# EAGLE schematic SIS Hub (EAGLE 7.3.0)
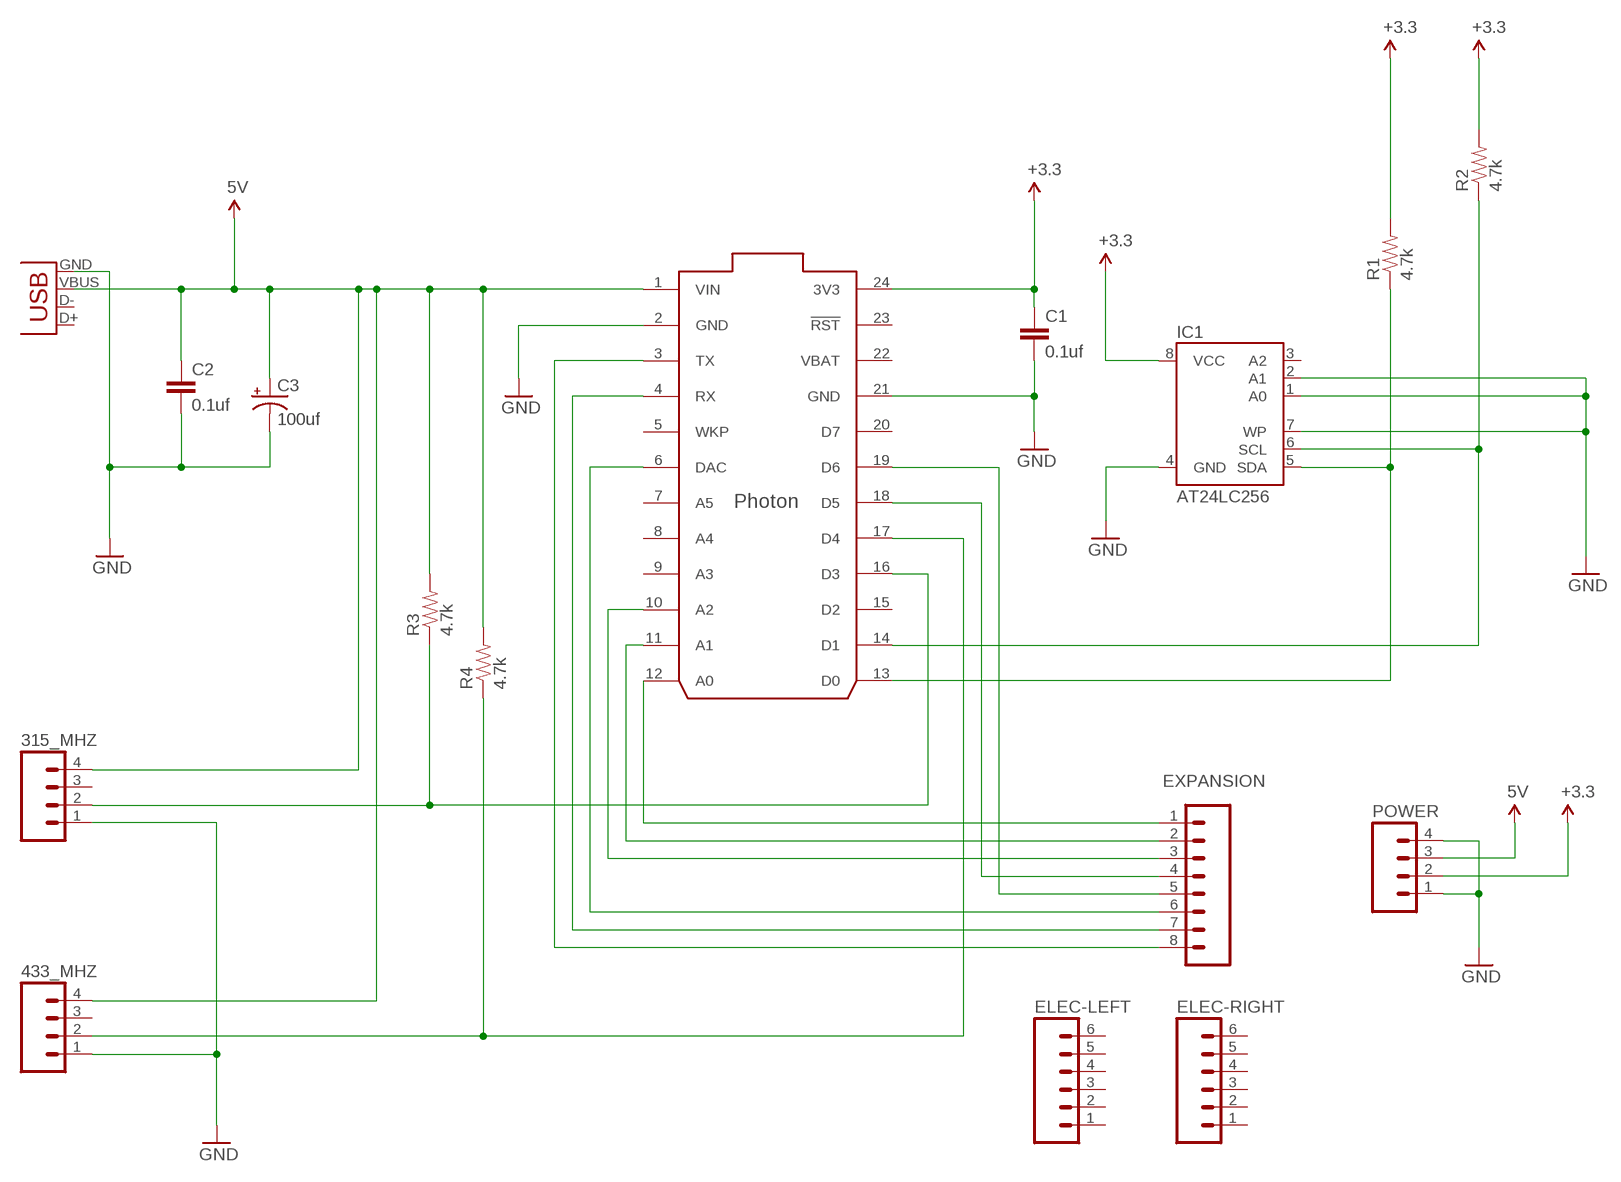
[diagram p0: schematic, sheet 1]

## Parts
315_MHZ  M04PTH  [1X04]
433_MHZ  M04PTH  [1X04]
C1  0.1uf  CAPKIT  [CAP-PTH-SMALL-KIT]
C2  0.1uf  CAPKIT  [CAP-PTH-SMALL-KIT]
C3  100uf  100UF-25V-20%(PTH)  [CPOL-RADIAL-100UF-25V]
ELEC-LEFT  M06NO_SILK_FEMALE_PTH  [1X06_NO_SILK]
ELEC-RIGHT  M06NO_SILK_FEMALE_PTH  [1X06_NO_SILK]
EXPANSION  M08SILK_FEMALE_PTH  [1X08]
IC1  AT24LC256  AT24CP  [DIL08]
JP1  USB-B  USBPTH  [USB-B-PTH]
POWER  M04PTH  [1X04]
R1  4.7k  RESISTORPTH-1/4W  [AXIAL-0.4]
R2  4.7k  RESISTORPTH-1/4W  [AXIAL-0.4]
R3  4.7k  RESISTORPTH-1/4W  [AXIAL-0.4]
R4  4.7k  RESISTORPTH-1/4W  [AXIAL-0.4]
U$1  PHOTON_WITH_HEADERS  [PHOTON]

## Nets
5V: 315_MHZ.4 433_MHZ.4 C2.1 C3.1(+) JP1.VBUS POWER.3 R3.P$2 R4.P$2 U$1.1(VIN)
GND: 315_MHZ.1 433_MHZ.1 C1.2 C2.2 C3.2(-) IC1.1(A0) IC1.2(A1) IC1.4(GND) IC1.7(WP) JP1.GND POWER.1 POWER.4 U$1.2(GND) U$1.21(GND)
N$1: IC1.5(SDA) R1.P$1 U$1.13(D0)
N$2: IC1.6(SCL) R2.P$1 U$1.14(D1)
N$3: 315_MHZ.2 R3.P$1 U$1.16(D3)
N$4: 433_MHZ.2 R4.P$1 U$1.17(D4)
N$5: EXPANSION.1 U$1.12(A0)
N$6: EXPANSION.4 U$1.18(D5)
N$7: EXPANSION.8 U$1.3(TX)
N$8: EXPANSION.7 U$1.4(RX)
N$9: EXPANSION.6 U$1.6(DAC)
N$10: EXPANSION.3 U$1.10(A2)
N$11: EXPANSION.2 U$1.11(A1)
N$12: EXPANSION.5 U$1.19(D6)
VCC: C1.1 IC1.8(VCC) POWER.2 R1.P$2 R2.P$2 U$1.24(3V3) ; supply symbol labelled +3.3
Unconnected: 315_MHZ.3 433_MHZ.3 ELEC-LEFT.1 ELEC-LEFT.2 ELEC-LEFT.3 ELEC-LEFT.4 ELEC-LEFT.5 ELEC-LEFT.6 ELEC-RIGHT.1 ELEC-RIGHT.2 ELEC-RIGHT.3 ELEC-RIGHT.4 ELEC-RIGHT.5 ELEC-RIGHT.6 IC1.3(A2) JP1.D+ JP1.D- U$1.5(WKP) U$1.7(A5) U$1.8(A4) U$1.9(A3) U$1.15(D2) U$1.20(D7) U$1.23(!RST)

## Power pins joined to a net without a drawn wire
VBAT: U$1.22(VBAT)

## Library data of the parts
315_MHZ 433_MHZ POWER = SparkFun-Connectors:M04: Header 4 Standard 4-pin 0.1" header. Use with straight break away headers (SKU : PRT-00116), right angle break away headers (PRT-00553), swiss pins (PRT-00743), machine pins (PRT-00117), and female headers (PRT-00115). Molex polarized connector foot print use with SKU : PRT-08231 with associated crimp pins and housings. 1MM SMD Version SKU: PRT-10208
C1 C2 = SparkFun-Capacitors:CAP: Capacitor Standard 0603 ceramic capacitor, and 0.1" leaded capacitor.
C3 = SparkFun-Capacitors:100UF-25V-20%(PTH): CAP-08439; PROD_ID: CAP-08439
ELEC-LEFT ELEC-RIGHT = SparkFun-Connectors:M06: Header 6 Standard 6-pin 0.1" header. Use with straight break away headers (SKU : PRT-00116), right angle break away headers (PRT-00553), swiss pins (PRT-00743), machine pins (PRT-00117), and female headers (PRT-00115). Molex polarized connector foot print use with SKU : PRT-08094 with associated crimp pins and housings. NOTES ON THE VARIANTS LOCK and LOCK_LONGPADS... This footprint was designed to help hold the alignment of a through-hole component (i.e. 6-pin header) while soldering it into place. You may notice that each hole has been shifted either up or down by 0.005 of an inch from it's more standard position (which is a perfectly straight line). This slight alteration caused the pins (the squares in the middle) to touch the edges of the holes. Because they are alternating, it causes a "brace" to hold the component in place. 0.005 has proven to be the perfect amount of "off-center" position when using our standard breakaway headers. Although looks a little odd when you look at the bare footprint, once you have a header in there, the alteration is very hard to notice. Also,if you push a header all the way into place, it is covered up entirely on the bottom side. This idea of altering the position of holes to aid alignment will be further integrated into the Sparkfun Library for other footprints. It can help hold any component with 3 or more connection pins.; PROD_ID: CONN-08437
EXPANSION = SparkFun-Connectors:M08: Header 8 Standard 8-pin 0.1" header. Use with straight break away headers (SKU : PRT-00116), right angle break away headers (PRT-00553), swiss pins (PRT-00743), machine pins (PRT-00117), and female headers (PRT-00115).; PROD_ID: CONN-08438
IC1 = atmel:AT24C*: 2-wire serial EEPROM; MPN: AT24C1024BW-SH-B; OC_FARNELL: 1362646; OC_NEWARK: 03P2044
JP1 = SparkFun-Connectors:USB: USB Connectors USB-B-PTH is fully proven SKU : PRT-00139/CONN-08278 USB-miniB is fully proven SKU : PRT-00587 USB-A-PCB is untested. USB-A-H is throughly reviewed, but untested. Spark Fun Electronics SKU : PRT-00437 USB-B-SMT is throughly reviewed, but untested. Needs silkscreen touching up. USB-A-S has not been used/tested USB-MB-H has not been used/tested USB-MICROB has been used. CONN-09505; PROD_ID: CONN-08278
R1-R4 = SparkFun-Passives:RESISTOR: Resistor Basic schematic elements and footprints for 0603, 1206, and PTH resistors.
U$1 = Spark:PHOTON